# EAGLE design SparkFun_Ardumoto_v14 (EAGLE 7.2.0)
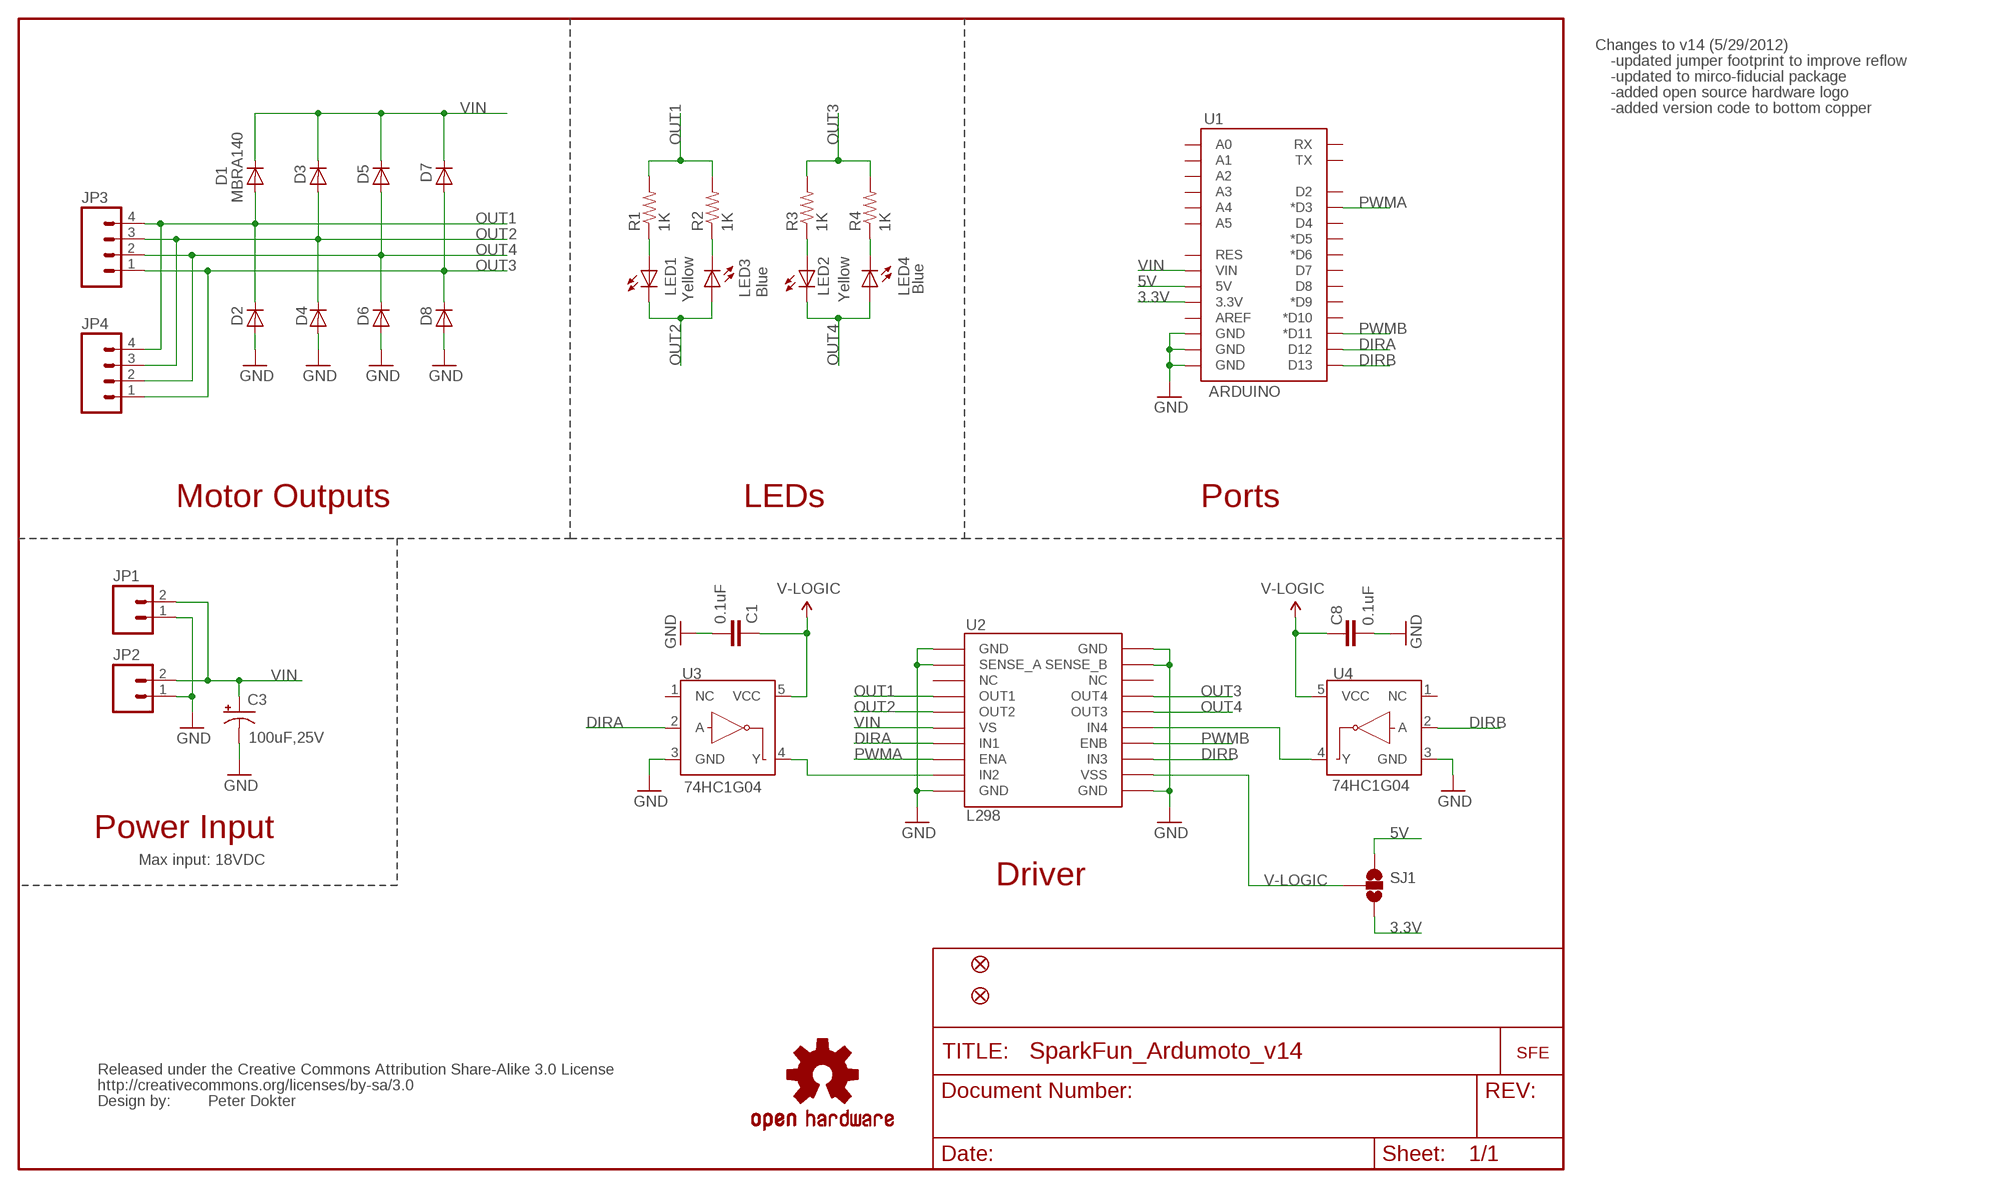
[diagram p0: schematic, sheet 1]

## Parts
C1  0.1uF  CAP0402-CAP  [0402-CAP]
C3  100uF,25V  CAP_POLF80  [NIPPON_F80]
C8  0.1uF  CAP0402-CAP  [0402-CAP]
D1  MBRA140  DIODESMA  [SMA-DIODE]
D2  MBRA140  DIODESMA  [SMA-DIODE]
D3  MBRA140  DIODESMA  [SMA-DIODE]
D4  MBRA140  DIODESMA  [SMA-DIODE]
D5  MBRA140  DIODESMA  [SMA-DIODE]
D6  MBRA140  DIODESMA  [SMA-DIODE]
D7  MBRA140  DIODESMA  [SMA-DIODE]
D8  MBRA140  DIODESMA  [SMA-DIODE]
JP1  M02PTH  [1X02]
JP2  M023.5MM  [SCREWTERMINAL-3.5MM-2]
JP3  M04SCREW  [SCREWTERMINAL-3.5MM-4]
JP4  M04PTH  [1X04]
JP5  FIDUCIALUFIDUCIAL  [MICRO-FIDUCIAL]
JP6  FIDUCIALUFIDUCIAL  [MICRO-FIDUCIAL]
LED1  Yellow  LED0603  [LED-0603]
LED2  Yellow  LED0603  [LED-0603]
LED3  Blue  LED0603  [LED-0603]
LED4  Blue  LED0603  [LED-0603]
R1  1K  RESISTOR0402-RES  [0402-RES]
R2  1K  RESISTOR0402-RES  [0402-RES]
R3  1K  RESISTOR0402-RES  [0402-RES]
R4  1K  RESISTOR0402-RES  [0402-RES]
SJ1  SOLDERJUMPER_2WAYPASTE1&2  [SJ_3_PASTE1&2]
U1  ARDUINO  ARDUINO_SHIELDNOLABELS  [DUEMILANOVE_SHIELD_NOLABELS]
U2  L298  L298_BRIDGE_DRIVER  [POWERSO20]
U3  74HC1G04  INVERTER""  [SC70]
U4  74HC1G04  INVERTER""  [SC70]
U$1  OSHW-LOGOS  [OSHW-LOGO-S]
U$10  LOGO-SFENEW  [SFE-NEW-WEBLOGO]
U$11  CREATIVE_COMMONS  [CREATIVE_COMMONS]

## Nets
3.3V: SJ1.3 U1.3.3V
5V: SJ1.1 U1.5V
DIRA: U1.D12 U2.7(IN1) U3.2(A)
DIRB: U1.D13 U2.13(IN3) U4.2(A)
GND: C1.2 C3.- C8.2 D2.A D4.A D6.A D8.A JP1.1 JP2.1 U1.GND@0(GND) U1.GND@1(GND) U1.GND@2(GND) U2.1(GND) U2.2(SENSE_A) U2.10(GND) U2.11(GND) U2.19(SENSE_B) U2.20(GND) U3.3(GND) U4.3(GND)
N$1: U2.9(IN2) U3.4(Y)
N$2: U2.15(IN4) U4.4(Y)
N$4: LED1.A R1.1
N$5: LED3.C R2.1
N$8: LED2.A R3.1
N$9: LED4.C R4.1
OUT1: D1.A D2.C JP3.4 JP4.4 R1.2 R2.2 U2.4(OUT1)
OUT2: D3.A D4.C JP3.3 JP4.3 LED1.C LED3.A U2.5(OUT2)
OUT3: D7.A D8.C JP3.1 JP4.1 R3.2 R4.2 U2.17(OUT4)
OUT4: D5.A D6.C JP3.2 JP4.2 LED2.C LED4.A U2.16(OUT3)
PWMA: U1.D3(*D3) U2.8(ENA)
PWMB: U1.D11(*D11) U2.14(ENB)
V-LOGIC: C1.1 C8.1 SJ1.2 U2.12(VSS) U3.5(VCC) U4.5(VCC)
VIN: C3.+ D1.C D3.C D5.C D7.C JP1.2 JP2.2 U1.VIN U2.6(VS)
Unconnected: U1.A0 U1.A1 U1.A2 U1.A3 U1.A4 U1.A5 U1.AREF U1.D2 U1.D4 U1.D5(*D5) U1.D6(*D6) U1.D7 U1.D8 U1.D9(*D9) U1.D10(*D10) U1.RES U1.RX U1.TX U2.3(NC) U2.18(NC) U3.1(NC) U4.1(NC)

## Notes on the sheet
- Changes to v14 (5/29/2012)
- -updated jumper footprint to improve reflow
- -updated to mirco-fiducial package
- -added open source hardware logo
- -added version code to bottom copper
- Motor Outputs | LEDs | Ports
- Power Input
- Max input: 18VDC
- Driver
- Peter Dokter

## Library data of the parts
C1 C8 = SparkFun:CAP: Capacitor Standard 0603 ceramic capacitor, and 0.1" leaded capacitor.
C3 = SparkFun:CAP_POL: Capacitor Polarized These are standard SMD and PTH capacitors. Normally 10uF, 47uF, and 100uF in electrolytic and tantalum varieties. Always verify the external diameter of the through hole cap, it varies with capacity, voltage, and manufacturer. The EIA devices should be standard.
D1-D8 = SparkFun:DIODE: Diode These are standard reverse protection diodes and small signal diodes. SMA package can handle up to about 1A. SOD-323 can handle about 200mA. What the SOD-323 package when ordering, there are some mfgs out there that are 5-pin packages.
JP1 JP2 = SparkFun:M02: Header 2 Standard 2-pin 0.1" header. Use with straight break away headers (SKU : PRT-00116), right angle break away headers (PRT-00553), swiss pins (PRT-00743), machine pins (PRT-00117), and female headers (PRT-00115). Molex polarized connector foot print use with SKU : PRT-08233 with associated crimp pins and housings.
JP3 JP4 = SparkFun:M04: Header 4 Standard 4-pin 0.1" header. Use with straight break away headers (SKU : PRT-00116), right angle break away headers (PRT-00553), swiss pins (PRT-00743), machine pins (PRT-00117), and female headers (PRT-00115). Molex polarized connector foot print use with SKU : PRT-08231 with associated crimp pins and housings. 1MM SMD Version SKU: PRT-10208
JP5 JP6 = SparkFun:FIDUCIAL: Fiducial Alignment Points Various fiducial points for machine vision alignment.
LED1-LED4 = SparkFun:LED: LEDs Standard schematic elements and footprints for 5mm, 3mm, 1206, and 0603 sized LEDs. 5mm - Spark Fun Electronics SKU : COM-00529 (and others)
R1-R4 = SparkFun:RESISTOR: Resistor Basic schematic elements and footprints for 0603, 1206, and PTH resistors.
SJ1 = SparkFun:SOLDERJUMPER_2WAY: Solder Jumper 2 way solder jumper
U1 = SparkFun:ARDUINO_SHIELD
U2 = SparkFun:L298_BRIDGE_DRIVER
U3 U4 = SparkFun:INVERTER: Single inverter, SOT23-5
U$1 = SparkFun:OSHW-LOGO: Open Source Hardware Logo This logo indicates the piece of hardware it is found on incorporates a OSHW license and/or adheres to the definition of open source hardware found here: http://freedomdefined.org/OSHW
U$10 = SparkFun:LOGO-SFE: Spark Fun Electronics PCB Logo This is the standard Spark Fun Electronics PCB logo.
U$11 = SparkFun:CREATIVE_COMMONS

## Net classes
1 power: width 0.61 mm

## Board
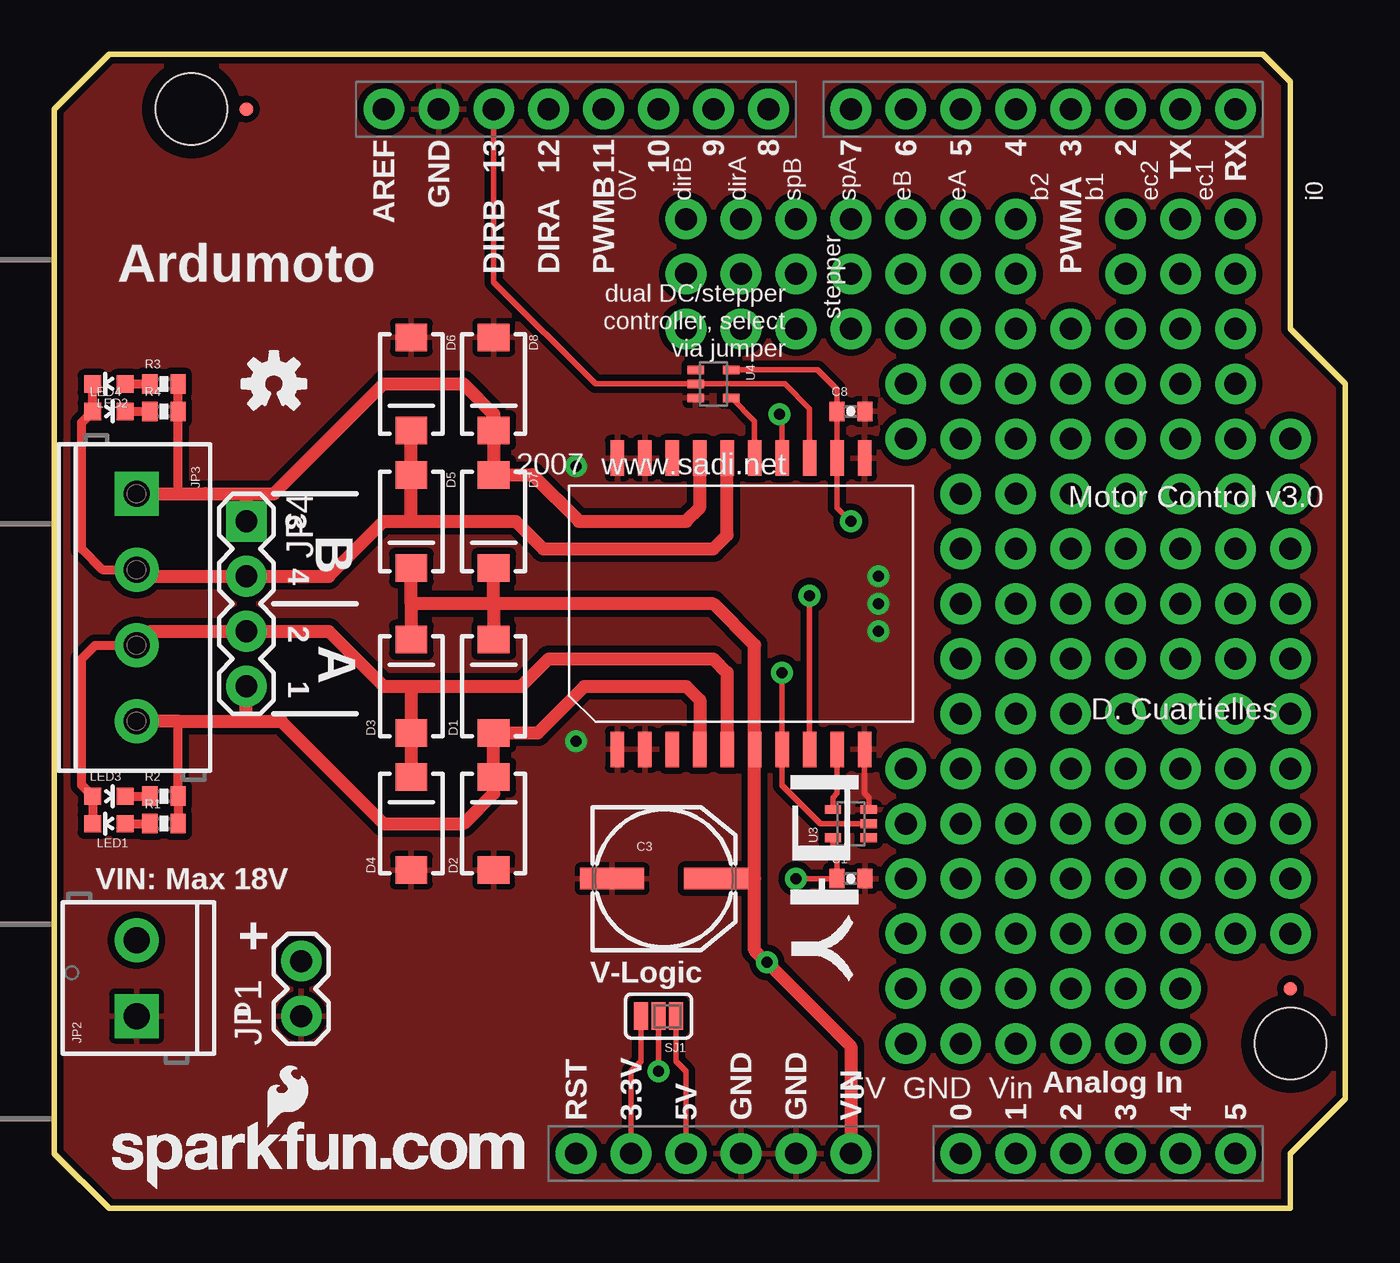
[diagram p1: board, top side]
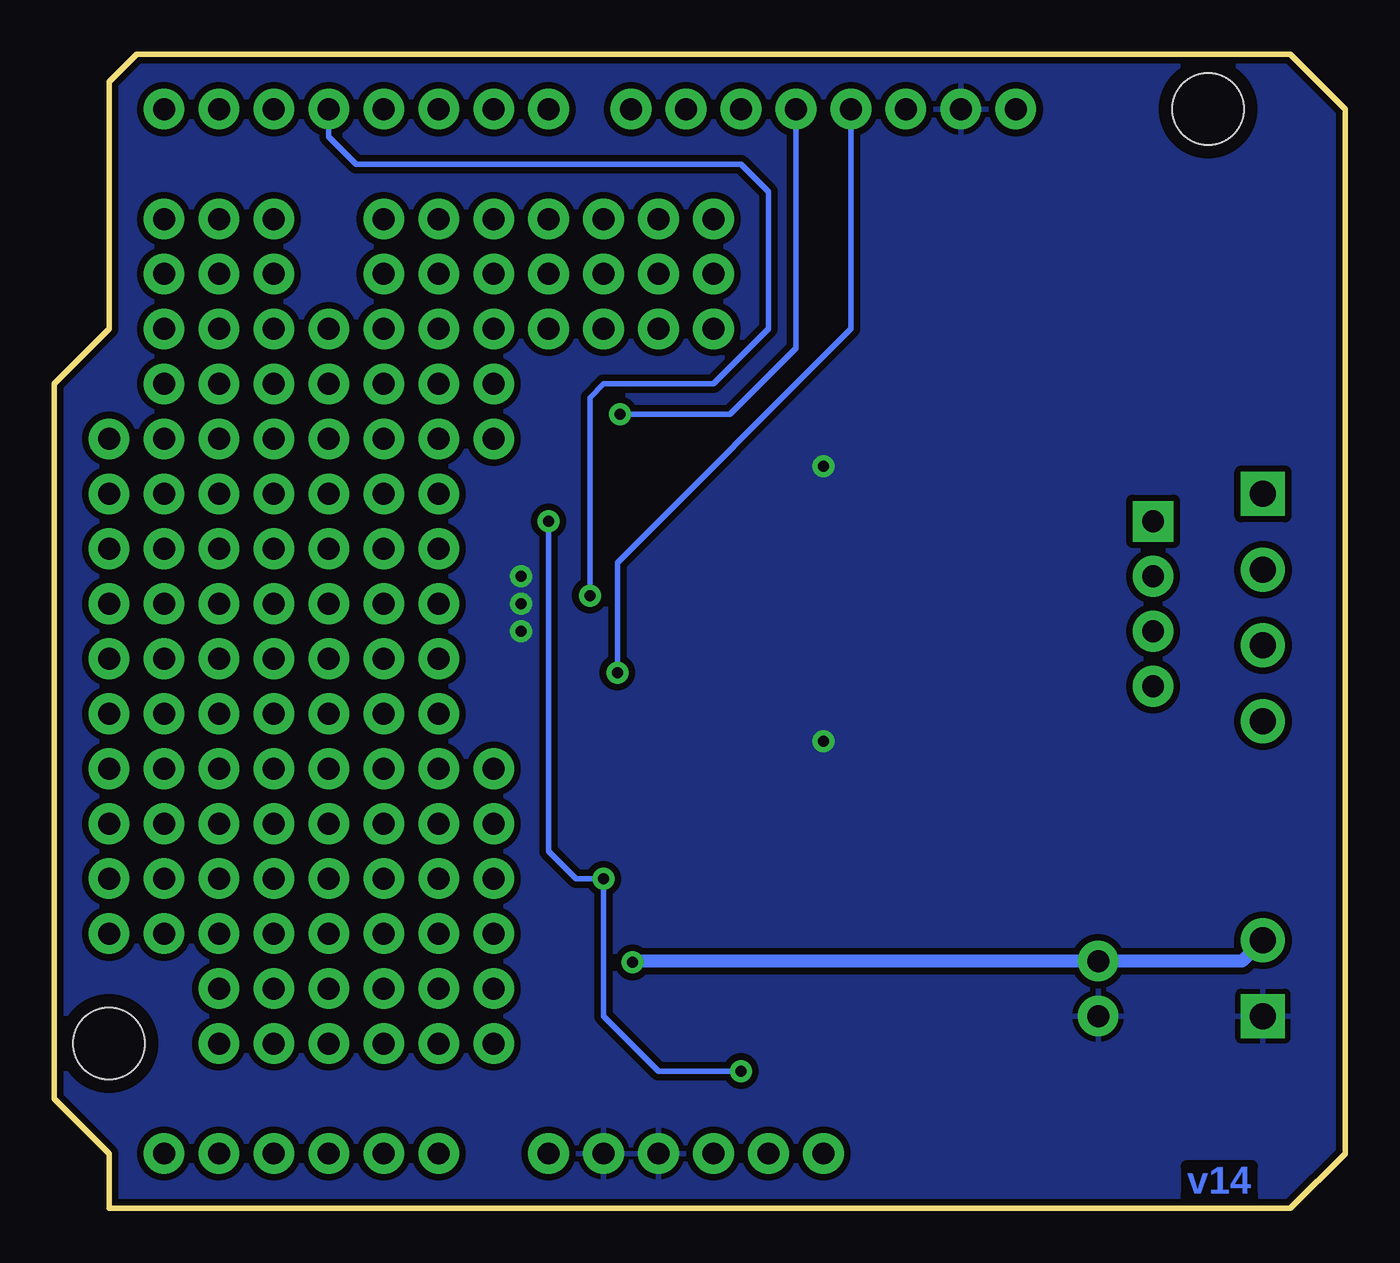
[diagram p2: board, bottom side, seen from below]

Size 59.69 x 53.34 mm. Coordinates in mm from the lower left corner, seen from the top.
Outline: 0,50.8 0,2.54 2.54,0 57.15,0 57.15,2.54 59.69,5.08 59.69,38.1 57.15,40.64 57.15,52.07 55.88,53.34 2.54,53.34 0,50.8
Copper layers (1*16): Top 0.035mm / dielectric 1.5mm / Bottom 0.035mm
Design rules "default": minimum track width 8mil, minimum drill 20mil, track to track 8mil, track to pad 8mil, pad to pad 8mil, via to via 8mil, smd to smd 8mil, copper to edge 10mil, drill to drill 8mil, minimum pad ring 12mil, minimum via ring 10mil, stop-mask expansion 4mil, vias tented up to drill 25mil, thermal gap 10mil

### Footprints (pad centres in the part's own frame; a part is rotated, then mirrored left to right if it is on the bottom)
0402-CAP = smd 0.7 x 0.9: 1 -0.65,0; 2 0.65,0
NIPPON_F80 = smd 2.95 x 1: + 2.4,0; - -2.4,0
SMA-DIODE = smd 1.27 x 1.47: A -2.15,0; C 2.15,0
1X02 = drill 1.016 pad 1.88: 1 0,0; 2 2.54,0
SCREWTERMINAL-3.5MM-2 = drill 1.2 pad 2.032 square: 1 0,0 | drill 1.2 pad 2.032: 2 3.5,0
SCREWTERMINAL-3.5MM-4 = drill 1.2 pad 2.032 square: 1 0,0 | drill 1.2 pad 2.032: 2 3.5,0; 3 7,0; 4 10.5,0
1X04 = drill 1.016 pad 1.88 square: 1 0,0 | drill 1.016 pad 1.88: 2 2.54,0; 3 5.08,0; 4 7.62,0
MICRO-FIDUCIAL = smd 0.635 x 0.635: 1 0,0
LED-0603 = smd 0.8 x 0.8: A 0,-0.75; C 0,0.75
0402-RES = smd 0.7 x 0.9: 1 -0.65,0; 2 0.65,0
SJ_3_PASTE1&2 = smd 0.635 x 1.27: 1 -0.813,0; 2 0,0; 3 0.813,0
DUEMILANOVE_SHIELD_NOLABELS = drill 1.016 pad 1.88: 3.3V 50.8,26.67; 5V 50.8,29.21; A0 50.8,41.91; A1 50.8,44.45; A2 50.8,46.99; A3 50.8,49.53; A4 50.8,52.07; A5 50.8,54.61; AREF 2.54,15.24; D2 2.54,49.53; D3 2.54,46.99; D4 2.54,44.45; D5 2.54,41.91; D6 2.54,39.37; D7 2.54,36.83; D8 2.54,33.02; D9 2.54,30.48; D10 2.54,27.94; D11 2.54,25.4; D12 2.54,22.86; D13 2.54,20.32; GND@0 50.8,31.75; GND@1 50.8,34.29; GND@2 2.54,17.78; RES 50.8,24.13; RX 2.54,54.61; TX 2.54,52.07; VIN 50.8,36.83 | hole 3.302: 45.72,57.15; 2.54,6.35
POWERSO20 = smd 1.651 x 0.635: 1 -6.731,5.715; 2 -6.731,4.445; 3 -6.731,3.175; 4 -6.731,1.905; 5 -6.731,0.635; 6 -6.731,-0.635; 7 -6.731,-1.905; 8 -6.731,-3.175; 9 -6.731,-4.445; 10 -6.731,-5.715; 11 6.731,-5.715; 12 6.731,-4.445; 13 6.731,-3.175; 14 6.731,-1.905; 15 6.731,-0.635; 16 6.731,0.635; 17 6.731,1.905; 18 6.731,3.175; 19 6.731,4.445; 20 6.731,5.715
SC70 = smd 0.4 x 0.75: 1 -0.65,-0.825; 2 0,-0.825; 3 0.65,-0.825; 4 0.65,0.825; 5 -0.65,0.825

### Placement (x,y rotation side)
C1  36.83,15.24 0 top
C3  28.19,15.24 0 top
C8  36.83,36.83 0 top
D1  20.32,24.13 90 top
D2  20.32,17.78 90 top
D3  16.51,24.13 90 top
D4  16.51,17.78 90 top
D5  16.51,31.75 270 top
D6  16.51,38.1 270 top
D7  20.32,31.75 270 top
D8  20.32,38.1 270 top
JP1  11.43,8.89 90 top
JP2  3.81,8.89 90 top
JP3  3.81,33.02 270 top
JP4  8.89,31.75 270 top
JP5  8.89,50.8 0 top
JP6  57.15,10.16 0 top
LED1  2.54,17.78 90 top
LED2  2.54,38.1 90 top
LED3  2.54,19.05 270 top
LED4  2.54,36.83 270 top
R1  5.08,17.78 0 top
R2  5.08,19.05 0 top
R3  5.08,38.1 0 top
R4  5.08,36.83 0 top
SJ1  27.94,8.89 180 top
U1  0,53.34 270 top
U2  31.75,27.94 90 top
U3  36.83,17.78 90 top
U4  30.48,38.1 270 top
U$1  10.16,38.1 0 top
U$10  2.67,0.89 0 top
U$11  21.59,-7.62 0 top  (outside the outline)

### Tracks (layer width: path | path; a pad name or v marks a point on that pad's centre or on a via)
3.3V
  Top 0.254: U1.3.3V 26.67,6.35 27.13,6.81 SJ1.3
5V
  Top 0.254: U1.5V 29.21,6.35 28.75,6.81 SJ1.1
DIRA  (via drill 0.51)
  Top 0.254: v33.66,24.77 U2.7 33.66,19.56 35.43,17.78 U3.2
  Bottom 0.254: v33.66,24.77 33.66,29.84 22.86,40.64 U1.D12
DIRB
  Top 0.254: U2.13 34.92,36.96 33.78,38.1 U4.2 25.02,38.1 20.32,42.8 U1.D13
GND  (via drill 0.51)
  Top 0.254: U2.10 37.47,19.18 37.66,18.99 U3.3 37.67,18.41
  other vias: 24.13,34.29 24.13,21.59 38.1,29.21 38.1,27.94 38.1,26.67
  pour Top (isolate 0.305): 0,53.34 0,0 59.69,0 59.69,53.34
  pour Bottom (isolate 0.305): 0,0 59.69,0 59.69,53.34 0,53.34
N$1
  Top 0.254: U2.9 36.2,19.18 36.01,18.99 U3.4
N$2
  Top 0.254: U2.15 32.38,36.37 U4.4
N$3  (via drill 1.02 pad 1.88)
  other vias: 54.61,38.1
N$4
  Top 0.406: LED1.A R1.1
N$5
  Top 0.406: LED3.C R2.1
N$6  (via drill 1.02 pad 1.88)
  other vias: 54.61,40.64
N$7  (via drill 1.02 pad 1.88)
  other vias: 54.61,43.18
N$8
  Top 0.406: LED2.A R3.1
N$9
  Top 0.406: LED4.C R4.1
N$10  (via drill 1.02 pad 1.88)
  other vias: 54.61,45.72
N$131  (via drill 1.02 pad 1.88)
  other vias: 54.61,12.7
N$157  (via drill 1.02 pad 1.88)
  other vias: 54.61,15.24
N$183  (via drill 1.02 pad 1.88)
  other vias: 54.61,17.78
N$209  (via drill 1.02 pad 1.88)
  other vias: 54.61,20.32
N$235  (via drill 1.02 pad 1.88)
  other vias: 54.61,22.86
N$261  (via drill 1.02 pad 1.88)
  other vias: 54.61,25.4
N$287  (via drill 1.02 pad 1.88)
  other vias: 54.61,27.94
N$313  (via drill 1.02 pad 1.88)
  other vias: 54.61,30.48
N$339  (via drill 1.02 pad 1.88)
  other vias: 41.91,17.78
N$340  (via drill 1.02 pad 1.88)
  other vias: 41.91,20.32
N$341  (via drill 1.02 pad 1.88)
  other vias: 41.91,22.86
N$342  (via drill 1.02 pad 1.88)
  other vias: 41.91,25.4
N$343  (via drill 1.02 pad 1.88)
  other vias: 41.91,27.94
N$344  (via drill 1.02 pad 1.88)
  other vias: 41.91,30.48
N$345  (via drill 1.02 pad 1.88)
  other vias: 41.91,33.02
N$346  (via drill 1.02 pad 1.88)
  other vias: 41.91,35.56
N$347  (via drill 1.02 pad 1.88)
  other vias: 41.91,38.1
N$348  (via drill 1.02 pad 1.88)
  other vias: 41.91,40.64
N$349  (via drill 1.02 pad 1.88)
  other vias: 41.91,43.18
N$350  (via drill 1.02 pad 1.88)
  other vias: 41.91,45.72
N$351  (via drill 1.02 pad 1.88)
  other vias: 41.91,7.62
N$352  (via drill 1.02 pad 1.88)
  other vias: 41.91,10.16
N$353  (via drill 1.02 pad 1.88)
  other vias: 41.91,12.7
N$354  (via drill 1.02 pad 1.88)
  other vias: 41.91,15.24
N$355  (via drill 1.02 pad 1.88)
  other vias: 39.37,7.62
N$365  (via drill 1.02 pad 1.88)
  other vias: 44.45,17.78
N$366  (via drill 1.02 pad 1.88)
  other vias: 44.45,20.32
N$367  (via drill 1.02 pad 1.88)
  other vias: 44.45,22.86
N$368  (via drill 1.02 pad 1.88)
  other vias: 44.45,25.4
N$369  (via drill 1.02 pad 1.88)
  other vias: 44.45,27.94
N$370  (via drill 1.02 pad 1.88)
  other vias: 44.45,30.48
N$371  (via drill 1.02 pad 1.88)
  other vias: 44.45,33.02
N$372  (via drill 1.02 pad 1.88)
  other vias: 44.45,35.56
N$373  (via drill 1.02 pad 1.88)
  other vias: 44.45,38.1
N$374  (via drill 1.02 pad 1.88)
  other vias: 44.45,40.64
N$375  (via drill 1.02 pad 1.88)
  other vias: 44.45,43.18
N$376  (via drill 1.02 pad 1.88)
  other vias: 44.45,45.72
N$377  (via drill 1.02 pad 1.88)
  other vias: 44.45,7.62
N$378  (via drill 1.02 pad 1.88)
  other vias: 44.45,10.16
N$379  (via drill 1.02 pad 1.88)
  other vias: 44.45,12.7
N$380  (via drill 1.02 pad 1.88)
  other vias: 44.45,15.24
N$381  (via drill 1.02 pad 1.88)
  other vias: 39.37,10.16
N$391  (via drill 1.02 pad 1.88)
  other vias: 46.99,17.78
N$392  (via drill 1.02 pad 1.88)
  other vias: 46.99,20.32
N$393  (via drill 1.02 pad 1.88)
  other vias: 46.99,22.86
N$394  (via drill 1.02 pad 1.88)
  other vias: 46.99,25.4
N$395  (via drill 1.02 pad 1.88)
  other vias: 46.99,27.94
N$396  (via drill 1.02 pad 1.88)
  other vias: 46.99,30.48
N$397  (via drill 1.02 pad 1.88)
  other vias: 46.99,33.02
N$398  (via drill 1.02 pad 1.88)
  other vias: 46.99,35.56
N$399  (via drill 1.02 pad 1.88)
  other vias: 46.99,38.1
N$400  (via drill 1.02 pad 1.88)
  other vias: 46.99,40.64
N$403  (via drill 1.02 pad 1.88)
  other vias: 46.99,7.62
N$404  (via drill 1.02 pad 1.88)
  other vias: 46.99,10.16
N$405  (via drill 1.02 pad 1.88)
  other vias: 46.99,12.7
N$406  (via drill 1.02 pad 1.88)
  other vias: 46.99,15.24
N$407  (via drill 1.02 pad 1.88)
  other vias: 39.37,12.7
N$417  (via drill 1.02 pad 1.88)
  other vias: 49.53,17.78
N$418  (via drill 1.02 pad 1.88)
  other vias: 49.53,20.32
N$419  (via drill 1.02 pad 1.88)
  other vias: 49.53,22.86
N$420  (via drill 1.02 pad 1.88)
  other vias: 49.53,25.4
N$421  (via drill 1.02 pad 1.88)
  other vias: 49.53,27.94
N$422  (via drill 1.02 pad 1.88)
  other vias: 49.53,30.48
N$423  (via drill 1.02 pad 1.88)
  other vias: 49.53,33.02
N$424  (via drill 1.02 pad 1.88)
  other vias: 49.53,35.56
N$425  (via drill 1.02 pad 1.88)
  other vias: 49.53,38.1
N$426  (via drill 1.02 pad 1.88)
  other vias: 49.53,40.64
N$427  (via drill 1.02 pad 1.88)
  other vias: 49.53,43.18
N$428  (via drill 1.02 pad 1.88)
  other vias: 49.53,45.72
N$429  (via drill 1.02 pad 1.88)
  other vias: 49.53,7.62
N$430  (via drill 1.02 pad 1.88)
  other vias: 49.53,10.16
N$431  (via drill 1.02 pad 1.88)
  other vias: 49.53,12.7
N$432  (via drill 1.02 pad 1.88)
  other vias: 49.53,15.24
N$433  (via drill 1.02 pad 1.88)
  other vias: 39.37,15.24
N$443  (via drill 1.02 pad 1.88)
  other vias: 52.07,17.78
N$444  (via drill 1.02 pad 1.88)
  other vias: 52.07,20.32
N$445  (via drill 1.02 pad 1.88)
  other vias: 52.07,22.86
N$446  (via drill 1.02 pad 1.88)
  other vias: 52.07,25.4
N$447  (via drill 1.02 pad 1.88)
  other vias: 52.07,27.94
N$448  (via drill 1.02 pad 1.88)
  other vias: 52.07,30.48
N$449  (via drill 1.02 pad 1.88)
  other vias: 52.07,33.02
N$450  (via drill 1.02 pad 1.88)
  other vias: 52.07,35.56
N$451  (via drill 1.02 pad 1.88)
  other vias: 52.07,38.1
N$452  (via drill 1.02 pad 1.88)
  other vias: 52.07,40.64
N$453  (via drill 1.02 pad 1.88)
  other vias: 52.07,43.18
N$454  (via drill 1.02 pad 1.88)
  other vias: 52.07,45.72
N$455  (via drill 1.02 pad 1.88)
  other vias: 52.07,7.62
N$456  (via drill 1.02 pad 1.88)
  other vias: 52.07,10.16
N$457  (via drill 1.02 pad 1.88)
  other vias: 52.07,12.7
N$458  (via drill 1.02 pad 1.88)
  other vias: 52.07,15.24
N$459  (via drill 1.02 pad 1.88)
  other vias: 39.37,17.78
N$460  (via drill 1.02 pad 1.88)
  other vias: 39.37,35.56
N$477  (via drill 1.02 pad 1.88)
  other vias: 31.75,40.64
N$478  (via drill 1.02 pad 1.88)
  other vias: 36.83,43.18
N$479  (via drill 1.02 pad 1.88)
  other vias: 29.21,43.18
N$480  (via drill 1.02 pad 1.88)
  other vias: 36.83,45.72
N$485  (via drill 1.02 pad 1.88)
  other vias: 39.37,20.32
N$486  (via drill 1.02 pad 1.88)
  other vias: 39.37,38.1
N$503  (via drill 1.02 pad 1.88)
  other vias: 29.21,40.64
N$504  (via drill 1.02 pad 1.88)
  other vias: 34.29,40.64
N$505  (via drill 1.02 pad 1.88)
  other vias: 31.75,43.18
N$506  (via drill 1.02 pad 1.88)
  other vias: 34.29,45.72
N$511  (via drill 1.02 pad 1.88)
  other vias: 54.61,33.02
N$512  (via drill 1.02 pad 1.88)
  other vias: 39.37,40.64
N$530  (via drill 1.02 pad 1.88)
  other vias: 36.83,40.64
N$531  (via drill 1.02 pad 1.88)
  other vias: 34.29,43.18
N$532  (via drill 1.02 pad 1.88)
  other vias: 31.75,45.72
N$537  (via drill 1.02 pad 1.88)
  other vias: 54.61,35.56
N$538  (via drill 1.02 pad 1.88)
  other vias: 39.37,43.18
N$547  (via drill 1.02 pad 1.88)
  other vias: 57.15,17.78
N$548  (via drill 1.02 pad 1.88)
  other vias: 57.15,20.32
N$549  (via drill 1.02 pad 1.88)
  other vias: 57.15,22.86
N$550  (via drill 1.02 pad 1.88)
  other vias: 57.15,25.4
N$551  (via drill 1.02 pad 1.88)
  other vias: 57.15,27.94
N$552  (via drill 1.02 pad 1.88)
  other vias: 57.15,30.48
N$553  (via drill 1.02 pad 1.88)
  other vias: 57.15,33.02
N$554  (via drill 1.02 pad 1.88)
  other vias: 57.15,35.56
N$557  (via drill 1.02 pad 1.88)
  other vias: 29.21,45.72
N$561  (via drill 1.02 pad 1.88)
  other vias: 57.15,12.7
N$562  (via drill 1.02 pad 1.88)
  other vias: 57.15,15.24
N$564  (via drill 1.02 pad 1.88)
  other vias: 39.37,45.72
OUT1
  Top 0.406: R1.2 R2.2 5.73,22.5 5.71,22.52
  Top 0.61: D1.A | D1.A D2.C 20.32,19.18 18.92,17.78 15.24,17.78 10.5,22.52 8.89,22.52 | JP3.4 5.71,22.52 8.89,22.52 | 8.89,22.52 JP4.4 | D1.A 22.36,21.98 24.51,24.13 29.21,24.13 29.84,23.5 U2.4
OUT2
  Top 0.406: LED1.C LED3.A 1.27,19.57 1.27,25.4 1.89,26.02 JP3.3
  Top 0.61: D4.C D3.A 16.51,24.13 | JP3.3 4.46,26.67 JP4.3 12.7,26.67 15.24,24.13 16.51,24.13 | 16.51,24.13 21.59,24.13 22.86,25.4 30.48,25.4 31.11,24.77 U2.5
OUT3
  Top 0.406: 7.11,33.02 7,33.13 | R3.2 R4.2 5.73,33.13 5.84,33.02
  Top 0.61: JP3.1 5.84,33.02 7.11,33.02 8.89,33.02 | 8.89,33.02 10.16,33.02 15.24,38.1 18.92,38.1 20.32,36.7 D8.C D7.A 22.1,33.91 24.26,31.75 29.21,31.75 29.84,32.38 U2.17 | 8.89,33.02 JP4.1
OUT4
  Top 0.406: LED2.C LED4.A 1.27,36.31 1.27,30.48 2.23,29.52 JP3.2
  Top 0.61: D6.C D5.A 16.51,31.75 | JP3.2 4.12,29.21 JP4.2 12.7,29.21 15.24,31.75 16.51,31.75 | 16.51,31.75 21.34,31.75 22.61,30.48 30.48,30.48 31.11,31.11 U2.16
PWMA  (via drill 0.51)
  Top 0.254: U2.8 v34.92,28.32
  Bottom 0.254: v34.92,28.32 34.92,37.47 34.29,38.1 29.21,38.1 26.67,40.64 26.67,46.99 27.94,48.26 45.72,48.26 46.99,49.53 U1.D3
PWMB  (via drill 0.51)
  Top 0.254: U2.14 33.66,36.58 v33.53,36.7
  Bottom 0.254: v33.53,36.7 28.45,36.7 25.4,39.75 U1.D11
V-LOGIC  (via drill 0.51)
  Top 0.254: U3.5 36.01,16.57 36.18,16.4 C1.1 v34.29,15.24 | v27.94,6.35 SJ1.2 | U4.5 35.29,38.75 36.18,37.86 C8.1 36.2,36.81 U2.12 36.2,32.38 v36.83,31.75
  Bottom 0.254: v36.83,31.75 36.83,16.51 35.56,15.24 v34.29,15.24 34.29,8.89 31.75,6.35 v27.94,6.35
VIN  (via drill 0.51)
  Top 0.61: 16.51,27.94 D3.C | 16.51,27.94 D5.C | 32.38,15.24 32.38,11.94 v32.96,11.37 36.83,7.49 U1.VIN | 32.38,15.24 U2.6 32.38,26.04 30.48,27.94 20.32,27.94 | 32.38,15.24 C3.+ | 20.32,27.94 D7.C | 20.32,27.94 16.51,27.94 | 20.32,27.94 D1.C
  Bottom 0.61: v32.96,11.37 32.89,11.43 JP1.2 4.77,11.43 JP2.2

### Text on the board
Bottom: v14
tPlace: AREF | GND | 13 | 12 | 11 | 10 | 9 | 8 | 7 | 6 | 5 | 4 | 3 | 2 | TX | RX | Ardumoto | DIRB | DIRA | PWMB | PWMA | 3 | B | 4 | 2 | A | 1 | VIN: Max 18V | + | V-Logic | - | Analog In | RST | 3.3V | 5V | GND | GND | VIN | 0 | 1 | 2 | 3 | 4 | 5
tNames: 0V | dirB | dirA | spB | spA | eB | eA | b2 | b1 | ec2 | ec1 | i0 | dual DC/stepper | controller, select | stepper | via jumper | 2007 www.sadi.net | Motor Control v3.0 | D. Cuartielles | 5V GND Vin
tValues: L298P013TR